# EAGLE design Debouncer (EAGLE 7.5.0)
Key debouncer and SPI carrier 4 channel switch debouncer and encoder signal conditioning. SPI for connecting a 2.2" TFT and memory card reader Status: Rework finished Placement final Routing finished

## Sheet 1 of 2: Babelfisch in tüten
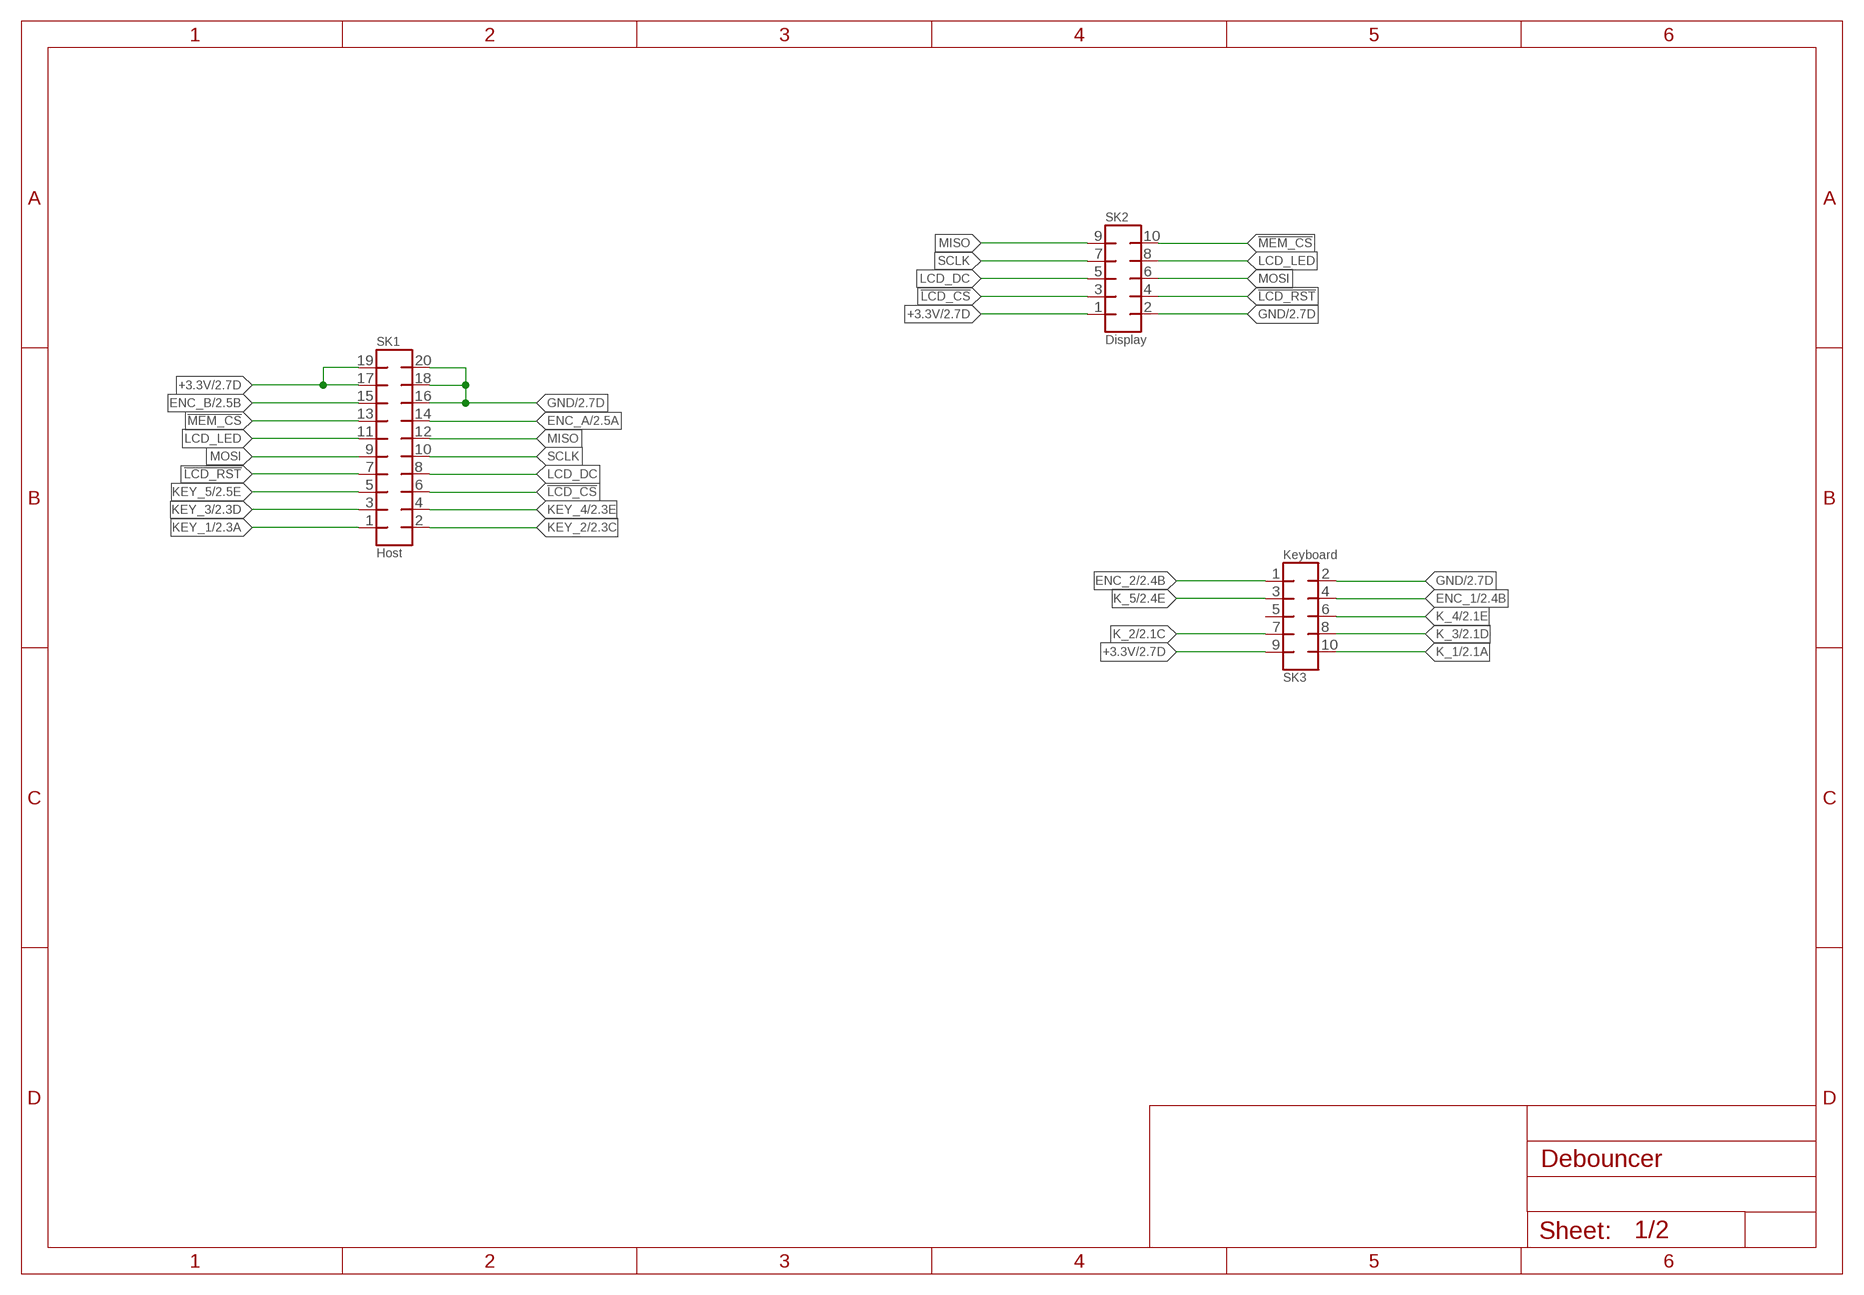
[diagram p0: schematic, sheet 1]

### Parts
SK1  Host  MMATCH-20-PTH  [AMP-215079-20]
SK2  Display  MMATCH-10-PTH  [AMP-215079-10]
SK3  Keyboard  MMATCH-10-PTH  [AMP-215079-10]

### Nets
!LCD_CS: SK1.6 SK2.3
!LCD_RST: SK1.7 SK2.4
!MEM_CS: SK1.13 SK2.10
+3.3V [Supply]: SK1.17 SK1.19 SK2.1 SK3.9 ; also sheet 2
ENC_1: SK3.4 ; also sheet 2
ENC_2: SK3.1 ; also sheet 2
ENC_A: SK1.14 ; also sheet 2
ENC_B: SK1.15 ; also sheet 2
GND [Supply]: SK1.16 SK1.18 SK1.20 SK2.2 SK3.2 ; also sheet 2
K_1: SK3.10 ; also sheet 2
K_2: SK3.7 ; also sheet 2
K_3: SK3.8 ; also sheet 2
K_4: SK3.6 ; also sheet 2
K_5: SK3.3 ; also sheet 2
KEY_1: SK1.1 ; also sheet 2
KEY_2: SK1.2 ; also sheet 2
KEY_3: SK1.3 ; also sheet 2
KEY_4: SK1.4 ; also sheet 2
KEY_5: SK1.5 ; also sheet 2
LCD_DC: SK1.8 SK2.5
LCD_LED: SK1.11 SK2.8
MISO: SK1.12 SK2.9
MOSI: SK1.9 SK2.6
SCLK: SK1.10 SK2.7
Unconnected: SK3.5

## Sheet 2 of 2: Debouncer Simple RC Schmitt-Trigger debouncer
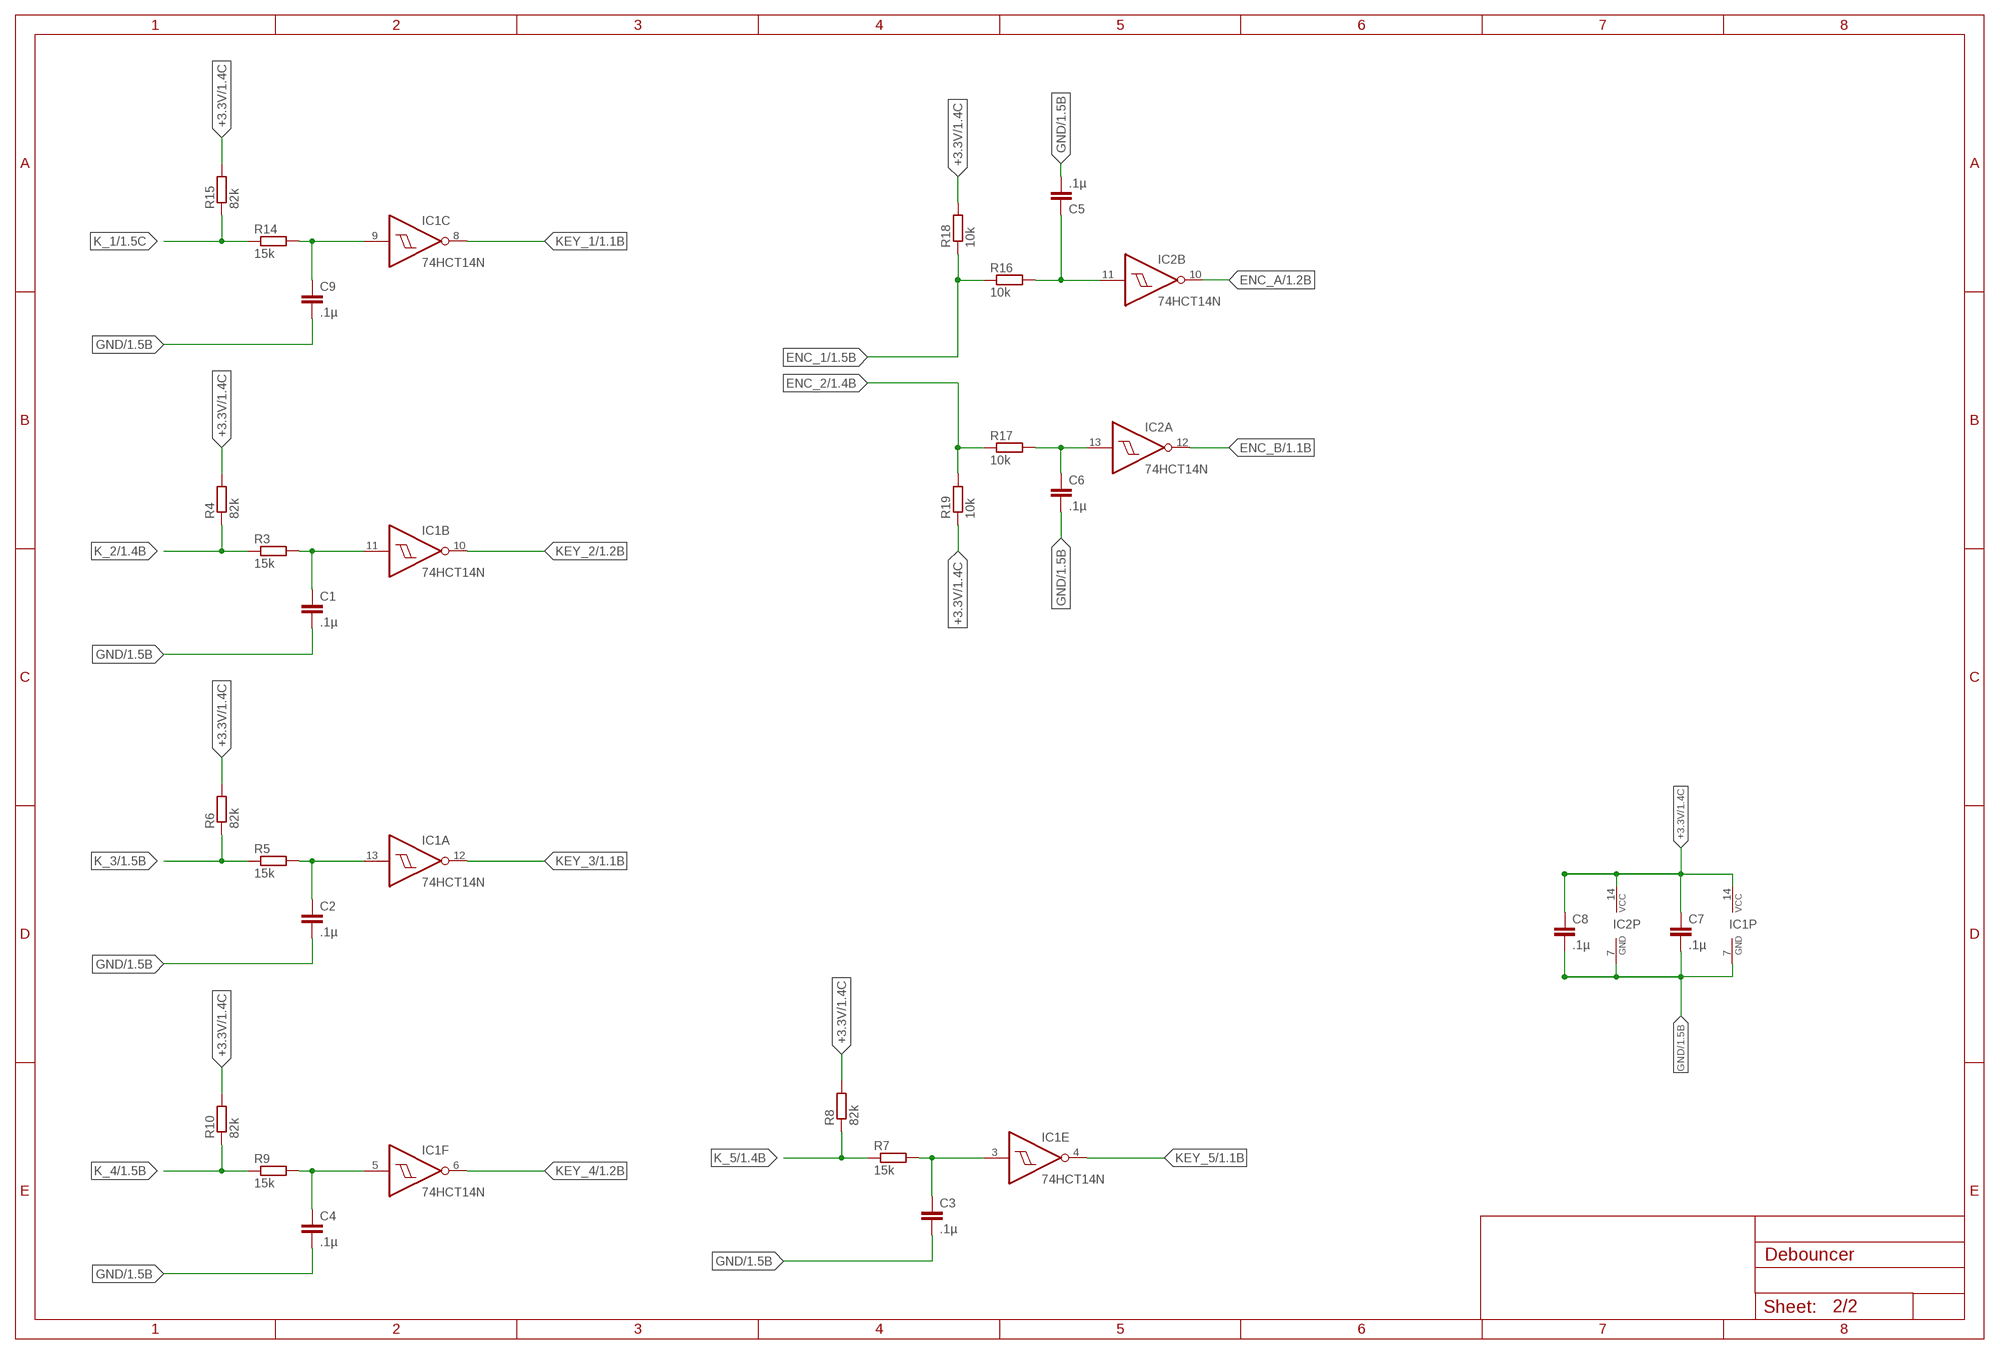
[diagram p1: schematic, sheet 2]

### Parts
C1  .1µ  C-EU025-024X044  [C025-024X044]
C2  .1µ  C-EU025-024X044  [C025-024X044]
C3  .1µ  C-EU025-024X044  [C025-024X044]
C4  .1µ  C-EU025-024X044  [C025-024X044]
C5  .1µ  C-EU025-024X044  [C025-024X044]
C6  .1µ  C-EU025-024X044  [C025-024X044]
C7  .1µ  C-EU025-024X044  [C025-024X044]
C8  .1µ  C-EU025-024X044  [C025-024X044]
C9  .1µ  C-EU025-024X044  [C025-024X044]
IC1  74HCT14N  [DIL14]
IC2  74HCT14N  [DIL14]
R3  15k  R-EU_0204/7  [0204/7]
R4  82k  R-EU_0204/7  [0204/7]
R5  15k  R-EU_0204/7  [0204/7]
R6  82k  R-EU_0204/7  [0204/7]
R7  15k  R-EU_0204/7  [0204/7]
R8  82k  R-EU_0204/7  [0204/7]
R9  15k  R-EU_0204/7  [0204/7]
R10  82k  R-EU_0204/7  [0204/7]
R14  15k  R-EU_0204/7  [0204/7]
R15  82k  R-EU_0204/7  [0204/7]
R16  10k  R-EU_0204/7  [0204/7]
R17  10k  R-EU_0204/7  [0204/7]
R18  10k  R-EU_0204/7  [0204/7]
R19  10k  R-EU_0204/7  [0204/7]

### Nets
+3.3V [Supply]: C7.1 C8.1 IC1.14(P:VCC) IC2.14(P:VCC) R4.2 R6.2 R8.2 R10.2 R15.2 R18.2 R19.1 ; also sheet 1
ENC1: C5.1 IC2.11(B:I) R16.2
ENC2: C6.1 IC2.13(A:I) R17.2
ENC_1: R16.1 R18.1 ; also sheet 1
ENC_2: R17.1 R19.2 ; also sheet 1
ENC_A: IC2.10(B:O) ; also sheet 1
ENC_B: IC2.12(A:O) ; also sheet 1
GND [Supply]: C1.2 C2.2 C3.2 C4.2 C5.2 C6.2 C7.2 C8.2 C9.2 IC1.7(P:GND) IC2.7(P:GND) ; also sheet 1
K1: C9.1 IC1.9(C:I) R14.2
K2: C1.1 IC1.11(B:I) R3.2
K3: C2.1 IC1.13(A:I) R5.2
K4: C3.1 IC1.3(E:I) R7.2
K5: C4.1 IC1.5(F:I) R9.2
K_1: R14.1 R15.1 ; also sheet 1
K_2: R3.1 R4.1 ; also sheet 1
K_3: R5.1 R6.1 ; also sheet 1
K_4: R9.1 R10.1 ; also sheet 1
K_5: R7.1 R8.1 ; also sheet 1
KEY_1: IC1.8(C:O) ; also sheet 1
KEY_2: IC1.10(B:O) ; also sheet 1
KEY_3: IC1.12(A:O) ; also sheet 1
KEY_4: IC1.6(F:O) ; also sheet 1
KEY_5: IC1.4(E:O) ; also sheet 1
Unconnected: IC1.1(D:I) IC1.2(D:O) IC2.1(D:I) IC2.2(D:O) IC2.3(E:I) IC2.4(E:O) IC2.5(F:I) IC2.6(F:O) IC2.8(C:O) IC2.9(C:I)

## Library data of the parts
C1-C9 = rcl:C-EU: CAPACITOR, European symbol
IC1 IC2 = 74xx-eu:74*14: Hex schmitt trigger INVERTER
R3-R10 R14-R19 = resistor:R-EU_: RESISTOR, European symbol
SK1 = jt-con-micromatch:MMATCH-20-*: AMP Micromatch 20-pin
SK2 SK3 = jt-con-micromatch:MMATCH-10-*: AMP Micromatch 10-pin

## Net classes
0 default: width 0.203 mm, drill 0.305 mm
1 Supply: width 0.406 mm, drill 0.305 mm

## Board
Debouncer Board Status: DRU ok
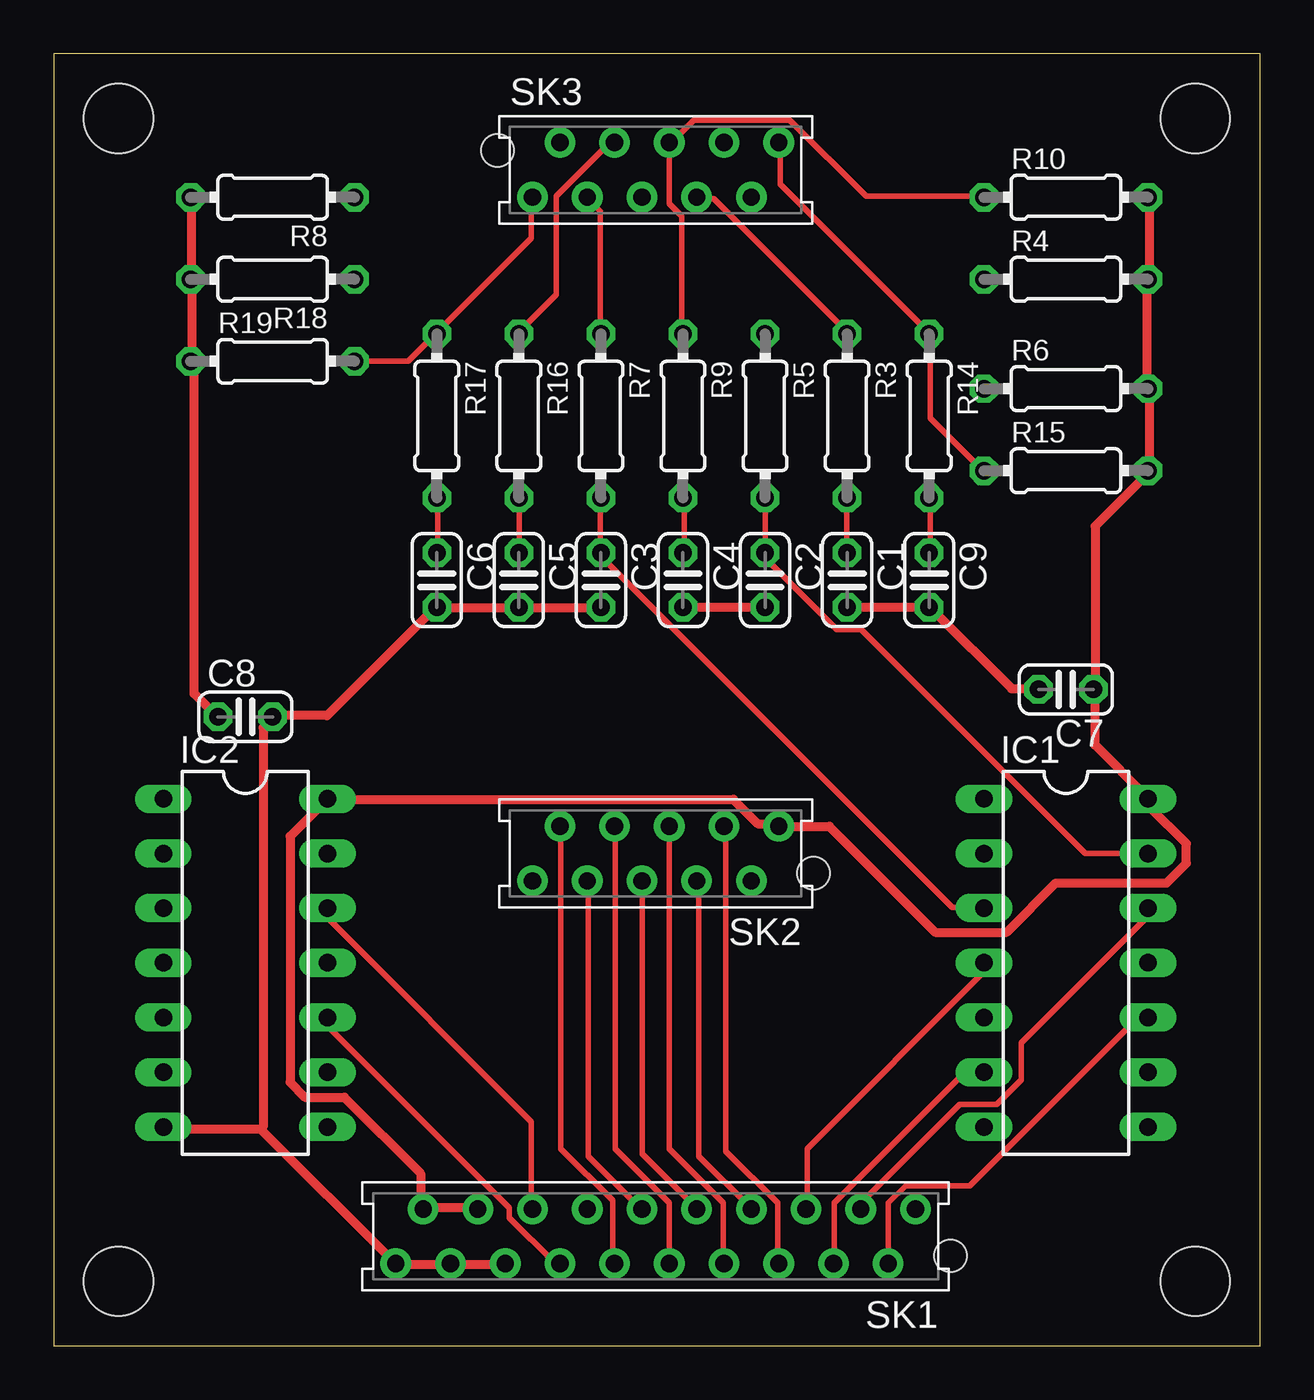
[diagram p2: board, top side]
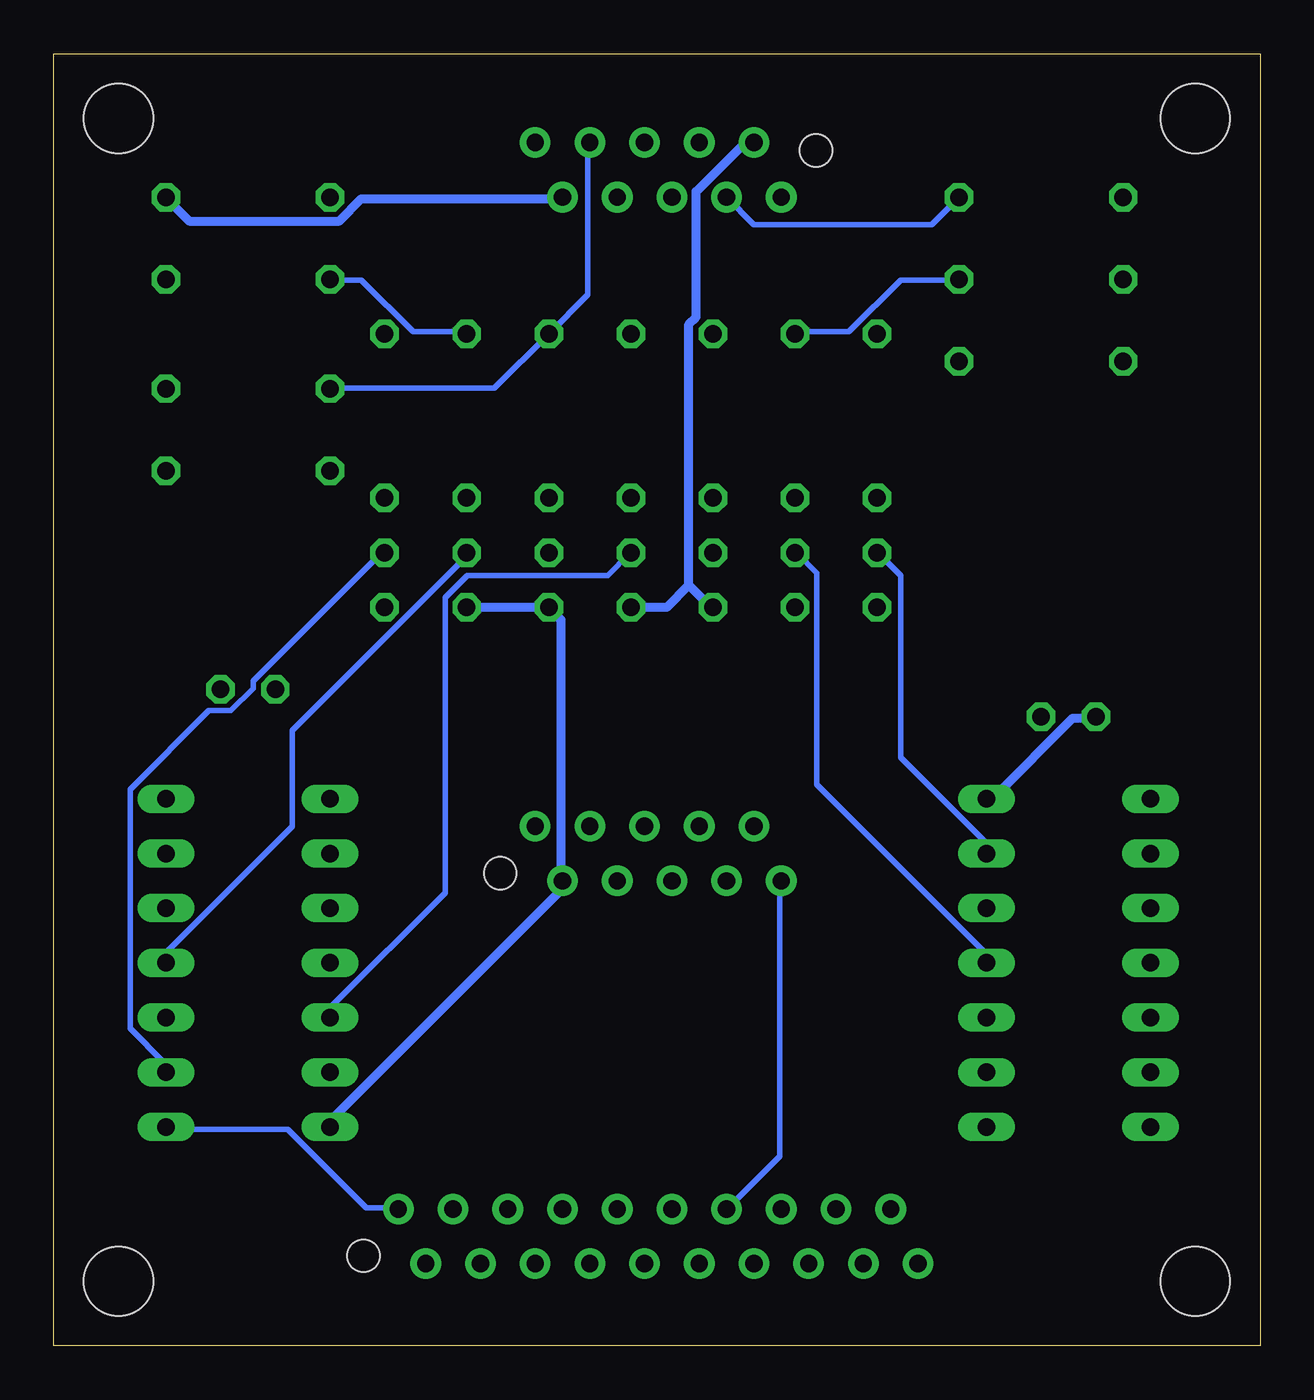
[diagram p3: board, bottom side, seen from below]

Size 56 x 60 mm. Coordinates in mm from the lower left corner, seen from the top.
Outline: 0,0 56,0 56,60 0,60 0,0
Copper layers (1*16): Top 0.035mm / dielectric 1.5mm / Bottom 0.035mm
Design rules "dirt_cheap_dirty_boards.v1": minimum track width 5mil, minimum drill 12mil, track to track 5mil, track to pad 5mil, pad to pad 5mil, via to via 5mil, smd to smd 0mil, copper to edge 10mil, drill to drill 10mil, minimum pad ring 10mil, minimum via ring 6mil, stop-mask expansion 2mil, vias tented up to drill 25mil, thermal gap 10mil
Holes 3.2 mm at 3,57 53,57 53,3 3,3
tKeepout: area 0.8,54.8 to 5.2,59.2; area 50.8,54.8 to 55.2,59.2; area 50.8,0.8 to 55.2,5.2; area 0.8,0.8 to 5.2,5.2
bKeepout: area 0.8,54.8 to 5.2,59.2; area 50.8,54.8 to 55.2,59.2; area 50.8,0.8 to 55.2,5.2; area 0.8,0.8 to 5.2,5.2

### Footprints (pad centres in the part's own frame; a part is rotated, then mirrored left to right if it is on the bottom)
C025-024X044 = drill 0.813 octagon: 1 -1.27,0; 2 1.27,0
DIL14 = drill 0.813 long: 1 -7.62,-3.81; 2 -5.08,-3.81; 3 -2.54,-3.81; 4 0,-3.81; 5 2.54,-3.81; 6 5.08,-3.81; 7 7.62,-3.81; 8 7.62,3.81; 9 5.08,3.81; 10 2.54,3.81; 11 0,3.81; 12 -2.54,3.81; 13 -5.08,3.81; 14 -7.62,3.81
0204/7 = drill 0.813 octagon: 1 -3.81,0; 2 3.81,0
AMP-215079-20 = drill 0.8 pad 1.422: 1 0,-1.27; 2 1.27,1.27; 3 2.54,-1.27; 4 3.81,1.27; 5 5.08,-1.27; 6 6.35,1.27; 7 7.62,-1.27; 8 8.89,1.27; 9 10.16,-1.27; 10 11.43,1.27; 11 12.7,-1.27; 12 13.97,1.27; 13 15.24,-1.27; 14 16.51,1.27; 15 17.78,-1.27; 16 19.05,1.27; 17 20.32,-1.27; 18 21.59,1.27; 19 22.86,-1.27; 20 24.13,1.27 | hole 1.5: -1.62,0.905
AMP-215079-10 = drill 0.8 pad 1.422: 1 0,-1.27; 2 1.27,1.27; 3 2.54,-1.27; 4 3.81,1.27; 5 5.08,-1.27; 6 6.35,1.27; 7 7.62,-1.27; 8 8.89,1.27; 9 10.16,-1.27; 10 11.43,1.27 | hole 1.5: -1.62,0.905

### Placement (x,y rotation side)
C1  36.83,35.56 270 top
C2  33.02,35.56 270 top
C3  25.4,35.56 270 top
C4  29.21,35.56 270 top
C5  21.59,35.56 270 top
C6  17.78,35.56 270 top
C7  46.99,30.48 180 top
C8  8.89,29.21 0 top
C9  40.64,35.56 270 top
IC1  46.99,17.78 270 top
IC2  8.89,17.78 270 top
R3  36.83,43.18 270 top
R4  46.99,49.53 0 top
R5  33.02,43.18 270 top
R6  46.99,44.45 0 top
R7  25.4,43.18 270 top
R8  10.16,53.34 180 top
R9  29.21,43.18 270 top
R10  46.99,53.34 0 top
R14  40.64,43.18 270 top
R15  46.99,40.64 0 top
R16  21.59,43.18 270 top
R17  17.78,43.18 270 top
R18  10.16,49.53 180 top
R19  10.16,45.72 0 top
SK1  40.01,5.08 180 top
SK2  33.66,22.86 180 top
SK3  22.23,54.61 0 top

### Tracks (layer width: path | path; a pad name or v marks a point on that pad's centre or on a via)
!LCD_CS
  Top 0.254: SK2.3 31.2,24.12 31.2,9.03 33.6,6.63 33.6,3.89 SK1.6
!LCD_RST
  Top 0.254: SK2.4 29.95,21.49 29.95,8.8 32.35,6.4 SK1.7
!MEM_CS
  Bottom 0.254: SK2.10 22.29,21.49 22.29,8.8 24.69,6.4 SK1.13
+3.3V
  Top 0.406: R10.2 50.86,53.26 50.86,49.61 R4.2 50.75,49.38 50.75,44.58 R6.2 50.86,44.35 50.86,40.69 R15.2 50.75,40.46 48.35,38.06 48.35,30.63 C7.1 48.35,30.4 48.35,27.89 50.75,25.49 IC1.14 50.86,25.26 50.86,25.03 52.58,23.32 52.58,22.4 51.66,21.49 46.52,21.49 44.23,19.2 40.92,19.2 36.01,24.12 33.83,24.12 SK2.1 33.6,24.23 32.69,24.23 31.55,25.38 12.8,25.38 IC2.14 12.57,25.26 10.97,23.66 10.97,12.23 11.66,11.54 13.49,11.54 17.03,8 17.03,6.51 SK1.19 17.14,6.4 19.66,6.4 SK1.17 | R8.2 6.4,53.26 6.4,49.72 R18.2 6.4,49.49 6.4,45.72 R19.1 6.51,45.61 6.51,30.29 7.54,29.26 C8.1
  Bottom 0.406: SK3.9 32.46,53.26 41.72,53.26 42.75,52.23 49.72,52.23 50.75,53.26 R10.2 | C8.1 7.66,29.15 8.69,29.15 12.34,25.49 12.69,25.49 IC2.14
ENC1
  Top 0.254: R16.2 21.6,39.32 21.6,36.92 C5.1
  Bottom 0.254: IC2.11 12.8,17.83 12.8,18.29 20.57,26.06 20.57,35.89 21.49,36.8 C5.1
ENC2
  Top 0.254: R17.2 17.83,39.32 17.83,36.92 C6.1
  Bottom 0.254: IC2.13 12.8,22.86 12.8,23.43 16.69,27.32 16.69,35.78 17.72,36.8 C6.1
ENC_1
  Top 0.254: SK3.4 25.95,55.78 25.72,55.78 23.32,53.38 23.32,48.81 21.6,47.09 R16.1
  Bottom 0.254: R16.1 21.49,47.09 19.09,47.09 16.69,49.49 14.06,49.49 R18.1
ENC_2
  Top 0.254: R19.2 16.46,45.72 17.72,46.98 R17.1 17.83,47.09 22.17,51.44 22.17,53.26 SK3.1
ENC_A
  Top 0.254: IC2.10 12.8,15.2 12.8,14.74 21.14,6.4 21.14,5.94 23.2,3.89 23.43,3.89 SK1.14
ENC_B
  Top 0.254: IC2.12 12.8,20.23 12.8,19.77 22.17,10.4 22.17,6.4 SK1.15
GND
  Top 0.406: 9.6,10.06 5.14,10.06 IC2.7 | 9.6,10.06 15.77,3.89 SK1.20 16,3.77 18.4,3.77 SK1.18 18.52,3.77 20.92,3.77 SK1.16 | C1.2 C9.2 40.8,34.18 44.46,30.52 45.72,30.52 C7.2 | C2.2 C4.2 | C3.2 C5.2 C6.2 17.72,34.29 12.69,29.26 10.17,29.26 C8.2 10.06,29.03 9.72,28.69 9.72,10.17 9.6,10.06
  Bottom 0.406: IC1.7 43.09,10.17 43.09,10.52 32.46,21.14 32.46,21.49 SK2.2 32.46,21.72 32.46,33.72 32.92,34.18 C2.2 C1.2 | 26.52,35.32 26.52,47.43 26.18,47.78 26.18,53.61 24,55.78 23.55,55.78 SK3.2 | 26.52,35.32 25.49,34.29 C3.2 | C4.2 27.55,34.29 26.52,35.32
K1
  Top 0.254: C9.1 40.69,36.92 40.69,39.32 R14.2
  Bottom 0.254: IC1.9 50.86,12.8 50.86,13.14 52.46,14.74 52.46,25.83 48.81,29.49 47.78,29.49 46.75,30.52 46.75,30.86 40.69,36.92 C9.1
K2
  Top 0.254: C1.1 36.8,36.92 36.8,39.32 R3.2
  Bottom 0.254: IC1.11 50.75,17.83 50.75,18.29 44.92,24.12 44.92,28.57 36.92,36.58 36.92,36.8 C1.1
K3
  Top 0.254: R5.2 33.03,39.32 33.03,36.92 C2.1 33.03,36.8 33.03,36.58 36.35,33.26 37.49,33.26 47.89,22.86 IC1.13
K4
  Top 0.254: IC1.3 43.09,20.34 41.72,20.34 25.49,36.58 25.49,36.8 C3.1 25.38,36.92 25.38,39.32 R7.2
K5
  Top 0.254: C4.1 29.26,36.92 29.26,39.32 R9.2
  Bottom 0.254: IC1.5 43.09,15.32 43.09,15.77 37.83,21.03 37.83,34.75 36.8,35.78 30.29,35.78 29.26,36.8 C4.1
K_1
  Top 0.254: R15.1 43.09,40.69 40.69,43.09 40.69,46.98 R14.1 40.58,47.09 33.72,53.95 33.72,55.78 SK3.10
K_2
  Top 0.254: SK3.7 29.95,53.26 30.63,53.26 36.8,47.09 R3.1
  Bottom 0.254: R3.1 36.92,47.09 39.32,47.09 41.72,49.49 43.09,49.49 R4.1
K_3
  Bottom 0.254: R6.1 43.09,44.46 35.55,44.46 R5.1 31.2,48.81 31.2,55.78 SK3.8
K_4
  Top 0.254: R9.1 29.15,47.09 29.15,52.46 28.57,53.03 SK3.6 28.69,55.89 29.72,56.92 34.18,56.92 37.72,53.38 43.09,53.38 R10.1
K_5
  Top 0.254: R7.1 25.38,47.09 25.38,52.69 24.8,53.26 SK3.3
  Bottom 0.254: SK3.3 23.5,52.07 15.24,52.07 R8.1
KEY_1
  Bottom 0.254: IC1.8 50.75,10.06 45.15,10.06 41.49,6.4 40.01,6.4 SK1.1
KEY_2
  Top 0.254: IC1.10 50.75,15.2 50.29,15.2 42.52,7.43 39.55,7.43 38.75,6.63 38.75,3.89 SK1.2
KEY_3
  Top 0.254: IC1.12 50.75,20.23 50.75,19.89 44.92,14.06 44.92,12.34 43.78,11.2 42.06,11.2 37.49,6.63 37.49,6.4 SK1.3
KEY_4
  Top 0.254: IC1.6 43.09,12.69 42.29,12.69 36.23,6.63 36.23,3.89 SK1.4
KEY_5
  Top 0.254: IC1.4 43.09,17.72 43.09,17.26 34.98,9.14 34.98,6.4 SK1.5
LCD_DC
  Top 0.254: SK2.5 28.57,9.14 31.09,6.63 31.09,3.89 SK1.8
LCD_LED
  Top 0.254: SK2.8 24.8,21.49 24.8,8.8 27.2,6.4 SK1.11
MISO
  Top 0.254: SK2.9 23.55,24.12 23.55,9.14 25.95,6.74 25.95,3.89 SK1.12
MOSI
  Top 0.254: SK2.6 27.32,21.49 27.32,8.91 29.83,6.4 SK1.9
SCLK
  Top 0.254: SK1.10 28.57,6.63 26.06,9.14 26.06,24.12 SK2.7